# EAGLE design VU meter schematic (EAGLE 9.2.2)
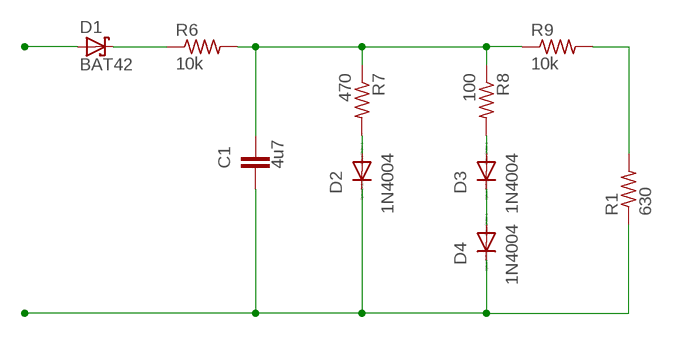
[diagram p0: schematic, sheet 1]

## Parts
C1  4u7  C2,5-3  [C2.5-3]
D1  BAT42  [DO35-10]
D2  1N4004  [DO41-10]
D3  1N4004  [DO41-10]
D4  1N4004  [DO41-10]
R1  630  R-US_0207/10  [0207/10]
R6  10k  R-US_0207/10  [0207/10]
R7  470  R-US_0207/10  [0207/10]
R8  100  R-US_0207/10  [0207/10]
R9  10k  R-US_0207/10  [0207/10]

## Nets
N$1: D1.C R6.1
N$2: C1.1 R6.2 R7.1 R8.1 R9.1
N$3: C1.2 D2.C D4.C R1.1
N$4: D1.A
N$5: R1.2 R9.2
N$6: D3.A R8.2
N$7: D3.C D4.A
N$8: D2.A R7.2

## Library data of the parts
C1 = capacitor-wima:C: CAPACITOR naming: grid - package width
D1 = diode:BAT42: DIODE barrier diode
D2-D4 = diode:1N4004: DIODE general purpose rectifier, 1 A
R1 R6-R9 = resistor:R-US_: RESISTOR, American symbol

## Net classes
0 default: width 0.305 mm, drill 0.508 mm, clearance 0.254 mm

## Board
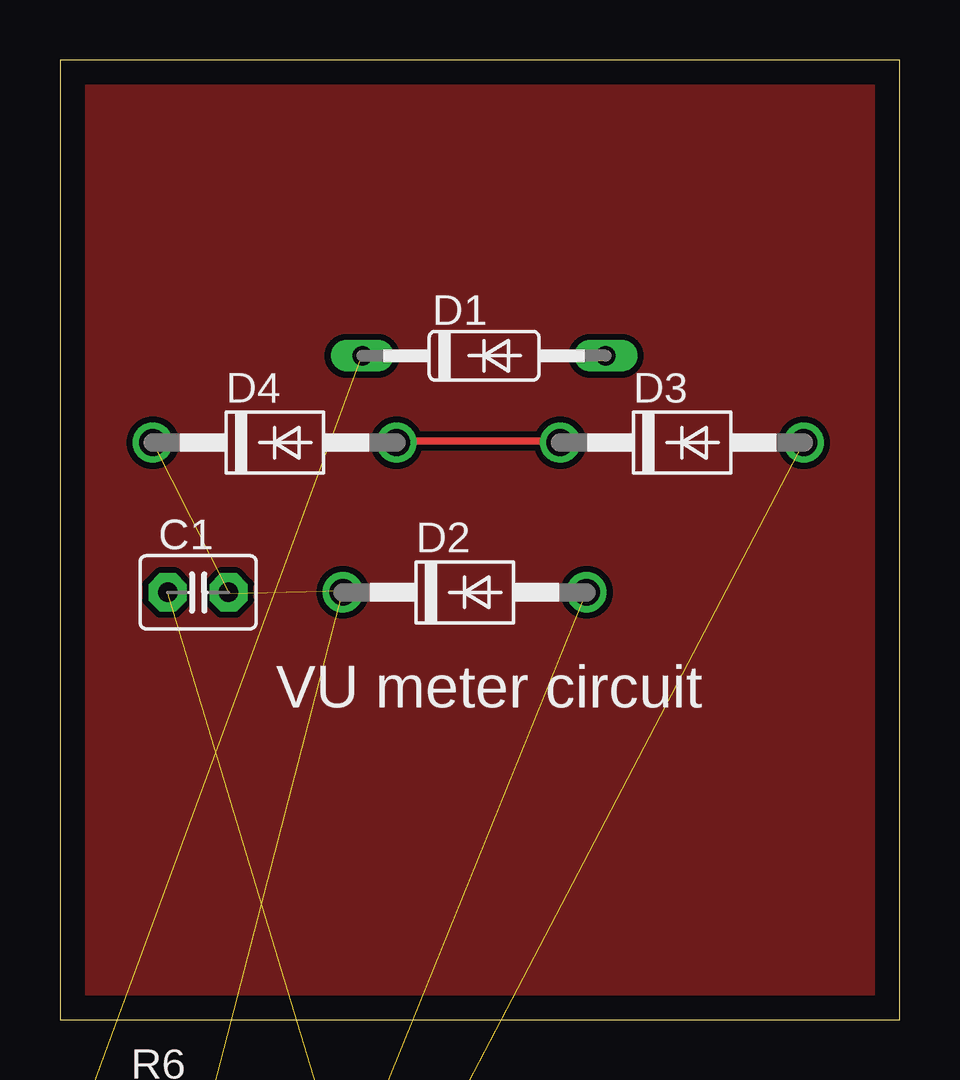
[diagram p1: board, top side]
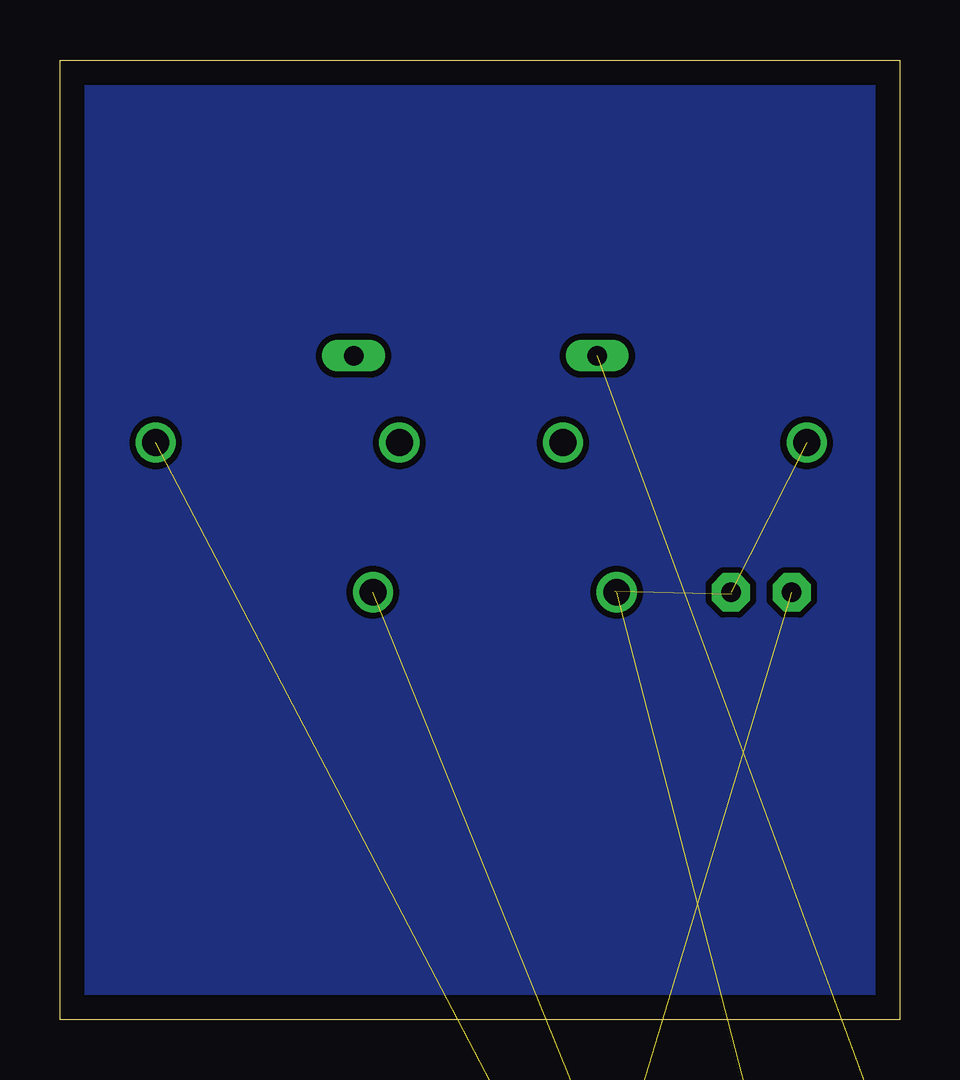
[diagram p2: board, bottom side, seen from below]

Size 35 x 40 mm. Coordinates in mm from the lower left corner, seen from the top.
Outline: 0,0 35,0 35,40 0,40 0,0
Copper layers (1*16): Top 0.035mm / dielectric 1.5mm / Bottom 0.035mm
Design rules "default": minimum track width 6mil, minimum drill 0.35mm, track to track 6mil, track to pad 6mil, pad to pad 6mil, via to via 6mil, smd to smd 6mil, copper to edge 40mil, drill to drill 6mil, minimum pad ring 10mil, minimum via ring 8mil, stop-mask expansion 4mil, vias tented up to drill 0mil, thermal gap 10mil

### Footprints (pad centres in the part's own frame; a part is rotated, then mirrored left to right if it is on the bottom)
C2.5-3 = drill 0.813 pad 1.6 octagon: 1 -1.27,0; 2 1.27,0
DO35-10 = drill 0.813 long: A 5.08,0; C -5.08,0
DO41-10 = drill 1.118: A 5.08,0; C -5.08,0
0207/10 = drill 0.813 octagon: 1 -5.08,0; 2 5.08,0

### Placement (x,y rotation side)
C1  5.76,17.81 0 top
D1  17.68,27.67 0 top
D2  16.87,17.81 0 top
D3  25.93,24.05 0 top
D4  8.95,24.05 0 top
R1  6,-24 0 top  (outside the outline)
R6  6,-4 0 top  (outside the outline)
R7  6,-9 0 top  (outside the outline)
R8  6,-14 0 top  (outside the outline)
R9  6,-19 0 top  (outside the outline)

### Tracks (layer width: path | path; a pad name or v marks a point on that pad's centre or on a via)
GND
  pour Top: 0,0 0,40 35,40 35,0
  pour Bottom: 0,0 0,40 35,40 35,0
N$1  (1 unrouted)
N$2  (4 unrouted)
N$3  (3 unrouted)
  Top 0.305: 7,17.75 C1.2 | 11.88,17.88 D2.C
N$5  (1 unrouted)
N$6  (1 unrouted)
N$7
  Top 0.305: D4.A 14.12,24.12 20.75,24.12 D3.C
N$8  (1 unrouted)

### Text on the board
tPlace: VU meter circuit